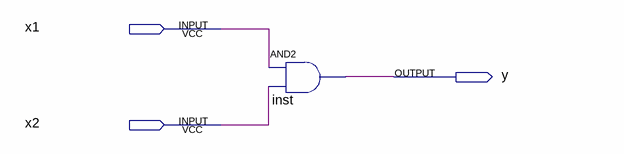
[diagram p0: schematic sheet]
// Quartus schematic lab11.bdf as structural Verilog: 1 symbols, 3 pins
module lab11 (
  input  x1,
  input  x2,
  output y
);

  and inst (y, x1, x2);
endmodule
